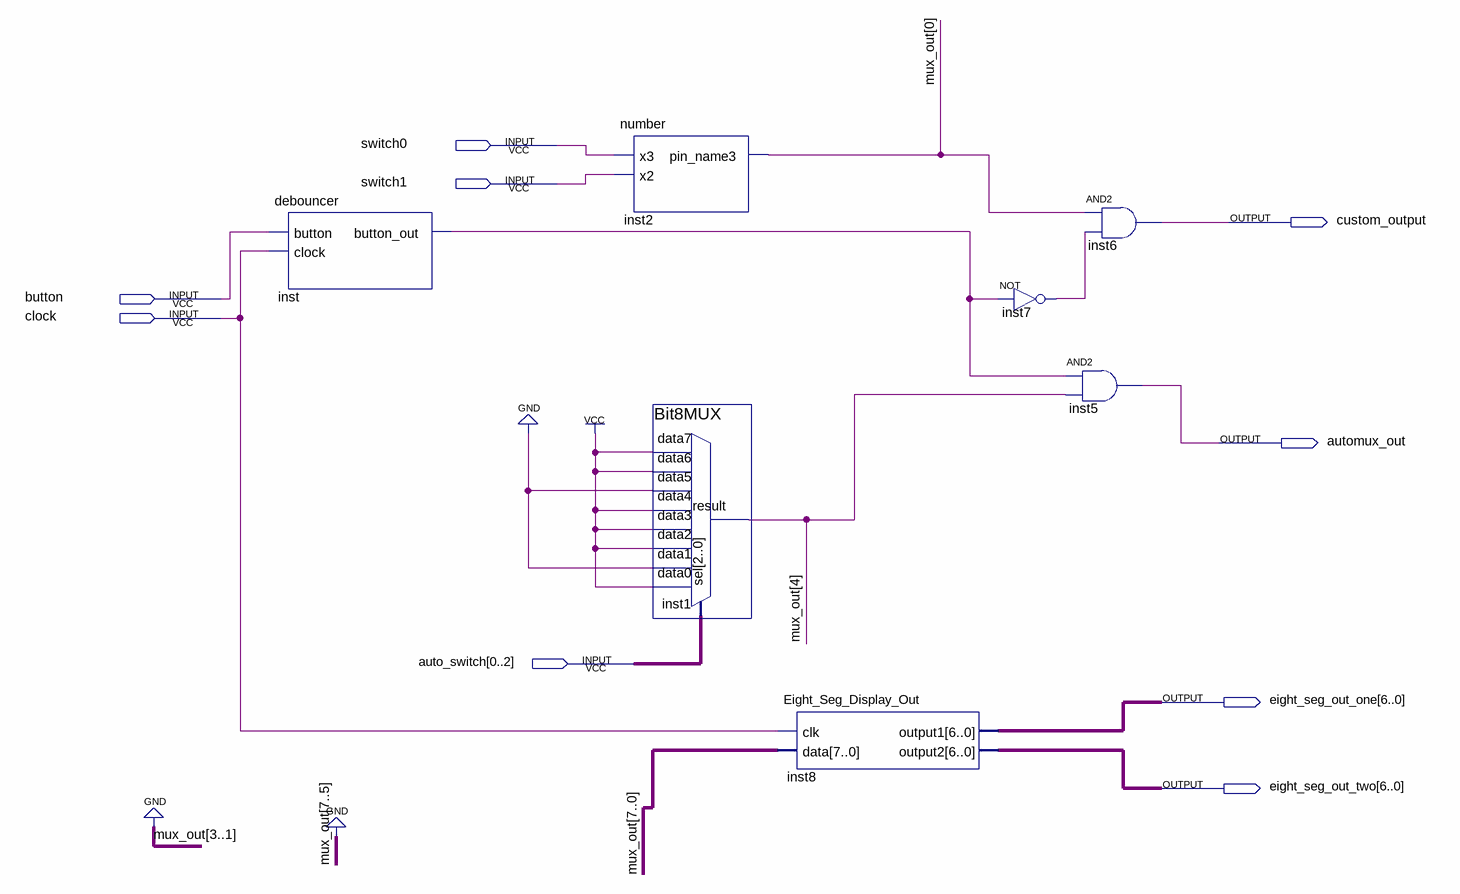
[diagram p0: schematic sheet]
// Quartus schematic Lab3.bdf as structural Verilog: 7 symbols, 9 pins
module Lab3 (
  input  switch0,
  input  switch1,
  input  button,
  input  clock,
  input  [0:2] auto_switch,
  output custom_output,
  output automux_out,
  output [6:0] eight_seg_out_one,
  output [6:0] eight_seg_out_two
);

  wire inst7_out, inst_button_out;
  wire [4:0] mux_out;

  debouncer inst (.button(button), .clock(clock), .button_out(inst_button_out));
  number inst2 (.x3(switch0), .x2(switch1), .pin_name3(mux_out[0]));
  Bit8MUX inst1 (
    .data7(1'b1), .data6(1'b1), .data5(1'b0), .data4(1'b1), .data3(1'b1), .data2(1'b1), .data1(1'b0),
    .data0(1'b1), .sel(auto_switch), .result(mux_out[4]));
  Eight_Seg_Display_Out inst8 (
    .clk(clock), .data({3'b000, mux_out[4], 3'b000, mux_out[0]}), .output1(eight_seg_out_one),
    .output2(eight_seg_out_two));
  not inst7 (inst7_out, inst_button_out);
  and inst6 (custom_output, mux_out[0], inst7_out);
  and inst5 (automux_out, inst_button_out, mux_out[4]);
endmodule
